# EAGLE design homecomputer-6502 (EAGLE 6.5.0)

## Sheet 1 of 4
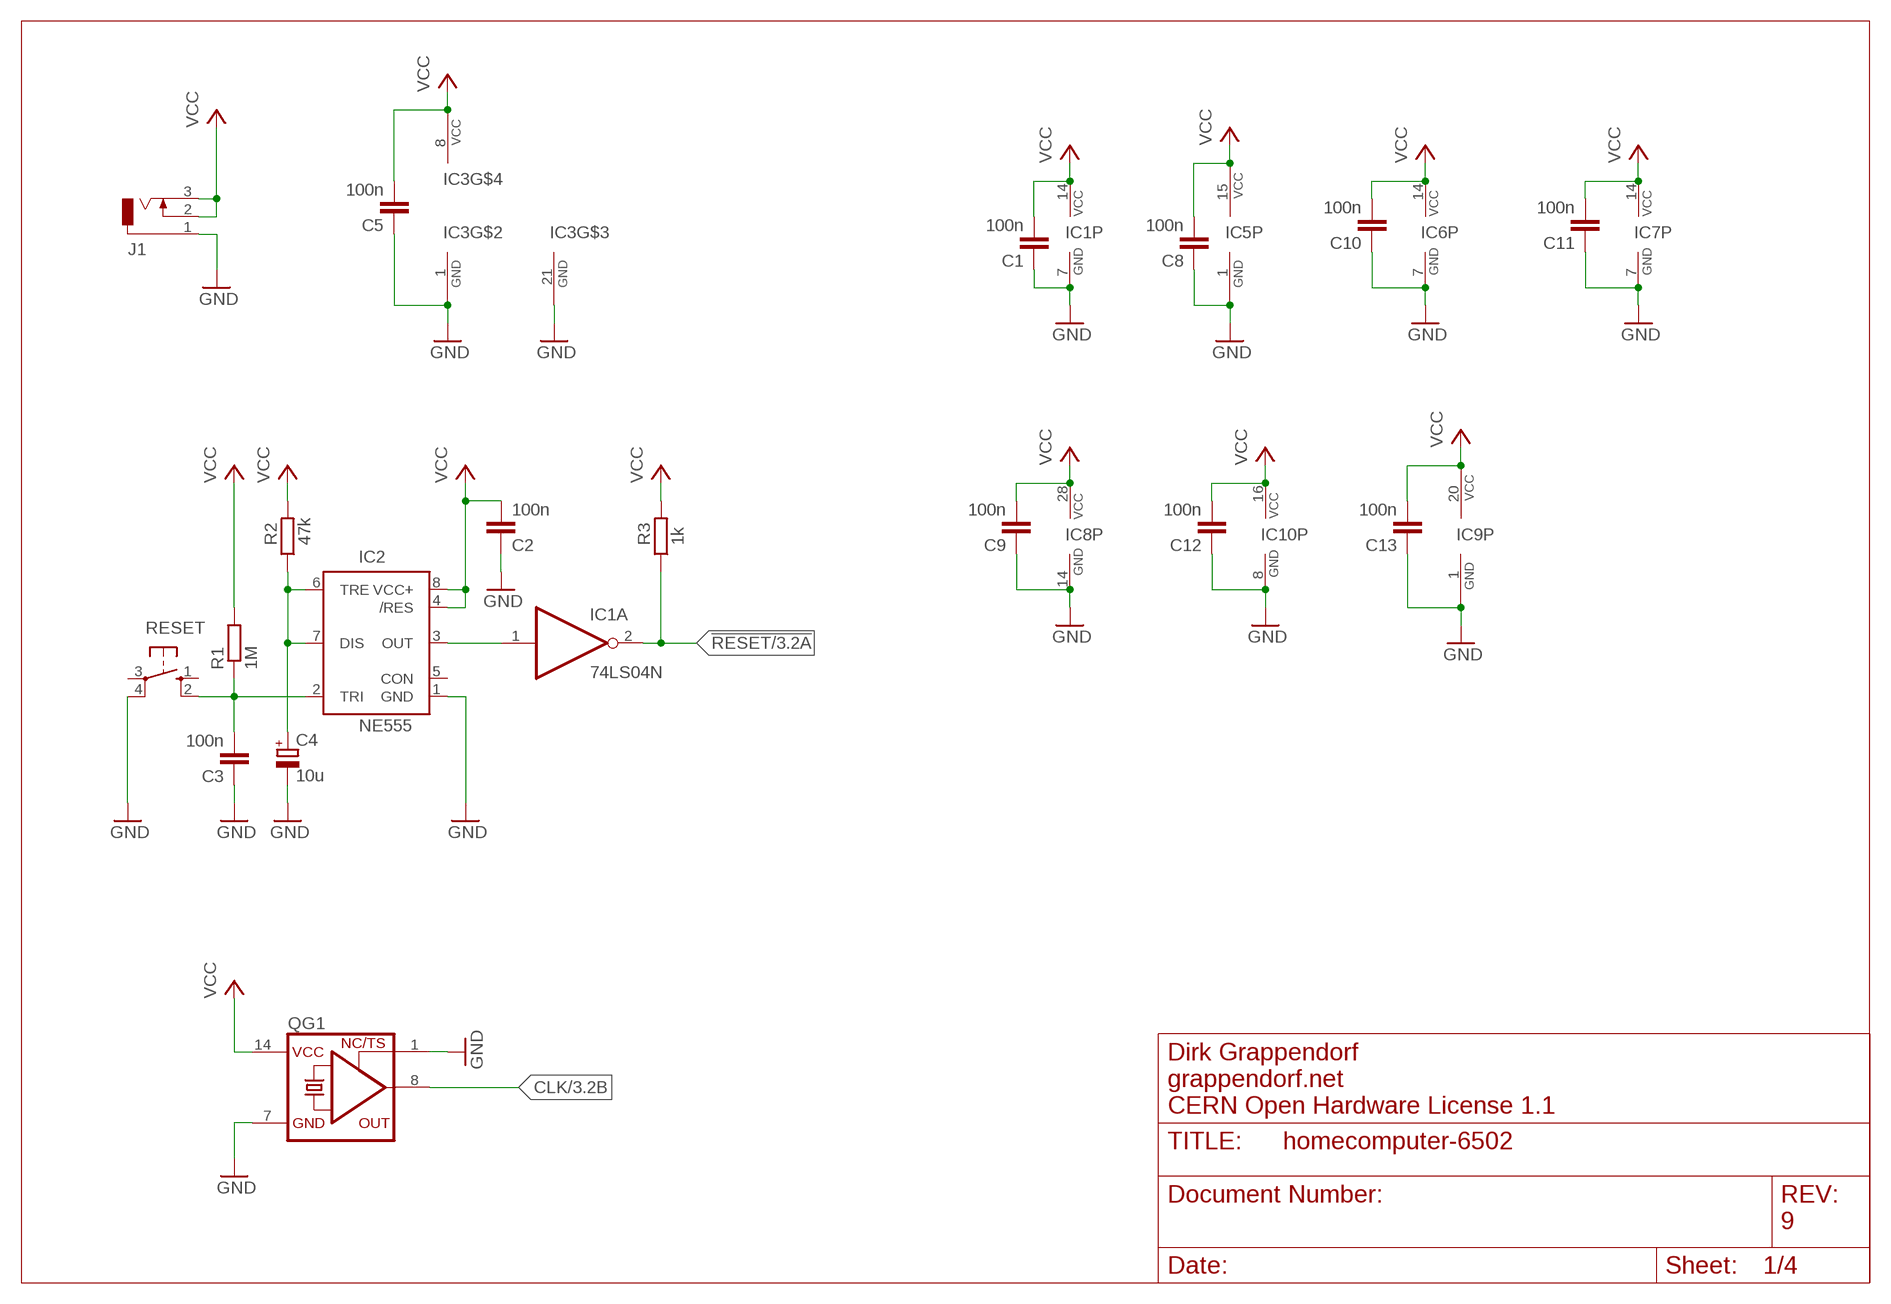
[diagram p0: schematic, sheet 1]

### Parts
C1  100n  C-EU025-024X044  [C025-024X044]
C2  100n  C-EU025-024X044  [C025-024X044]
C3  100n  C-EU025-024X044  [C025-024X044]
C4  10u  CPOL-EUE2,5-6E  [E2,5-6E]
C5  100n  C-EU025-024X044  [C025-024X044]
C8  100n  C-EU025-024X044  [C025-024X044]
C9  100n  C-EU025-024X044  [C025-024X044]
C10  100n  C-EU025-024X044  [C025-024X044]
C11  100n  C-EU025-024X044  [C025-024X044]
C12  100n  C-EU025-024X044  [C025-024X044]
C13  100n  C-EU025-024X044  [C025-024X044]
IC1  74LS04N  [DIL14]
IC2  NE555  [DIL-08]
IC3  6502  [DIP40]
IC5  6551  [DIP28]
IC6  74LS00N  [DIL14]
IC7  74LS30N  [DIL14]
IC8  61256  [DIL28-3]
IC9  6522  [DIP40]
IC10  74LS137N  [DIL16]
J1  DCJ0303  [DCJ0303]
QG1  XO-14  [DIL14S]
R1  1M  R-EU_0204/5  [0204/5]
R2  47k  R-EU_0204/5  [0204/5]
R3  1k  R-EU_0204/5  [0204/5]
RESET  10-XX  [B3F-10XX]

### Nets
!RESET: IC1.2(A:O) R3.1 ; also sheet 3,4
CLK: QG1.8(OUT) ; also sheet 3
GND: C1.1 C2.1 C3.1 C4.- C5.1 C8.1 C9.1 C10.1 C11.1 C12.1 C13.1 IC1.7(P:GND) IC2.1(GND) IC3.1(GND) IC3.21(GND) IC5.1(GND) IC6.7(P:GND) IC7.7(GND) IC8.14(GND) IC9.1(GND) IC10.8(GND) J1.1 QG1.1(TS) QG1.7(GND) RESET.4(P1) ; also sheet 2,3,4
N$4: C4.+ IC2.6(TRE) IC2.7(DIS) R2.1
N$5: IC1.1(A:I) IC2.3(OUT)
N$6: C3.2 IC2.2(TRI) R1.1 RESET.2(S1)
VCC: C1.2 C2.2 C5.2 C8.2 C9.2 C10.2 C11.2 C12.2 C13.2 IC1.14(P:VCC) IC2.4(/RES) IC2.8(VCC+) IC3.8(VCC) IC5.15(VCC) IC6.14(P:VCC) IC7.14(VCC) IC8.28(VCC) IC9.20(VCC) IC10.16(VCC) J1.2 J1.3 QG1.14(VCC) R1.2 R2.2 R3.2 ; also sheet 2,3,4
Unconnected: IC1.5(C:I) IC1.6(C:O) IC1.8(D:O) IC1.9(D:I) IC1.12(F:O) IC1.13(F:I) IC2.5(CON) IC6.8(C:O) IC6.9(C:I0) IC6.10(C:I1) IC6.11(D:O) IC6.12(D:I0) IC6.13(D:I1) RESET.1(S) RESET.3(P)

### Notes on the sheet
- Dirk Grappendorf
- grappendorf.net
- CERN Open Hardware License 1.1
- 9

## Sheet 2 of 4
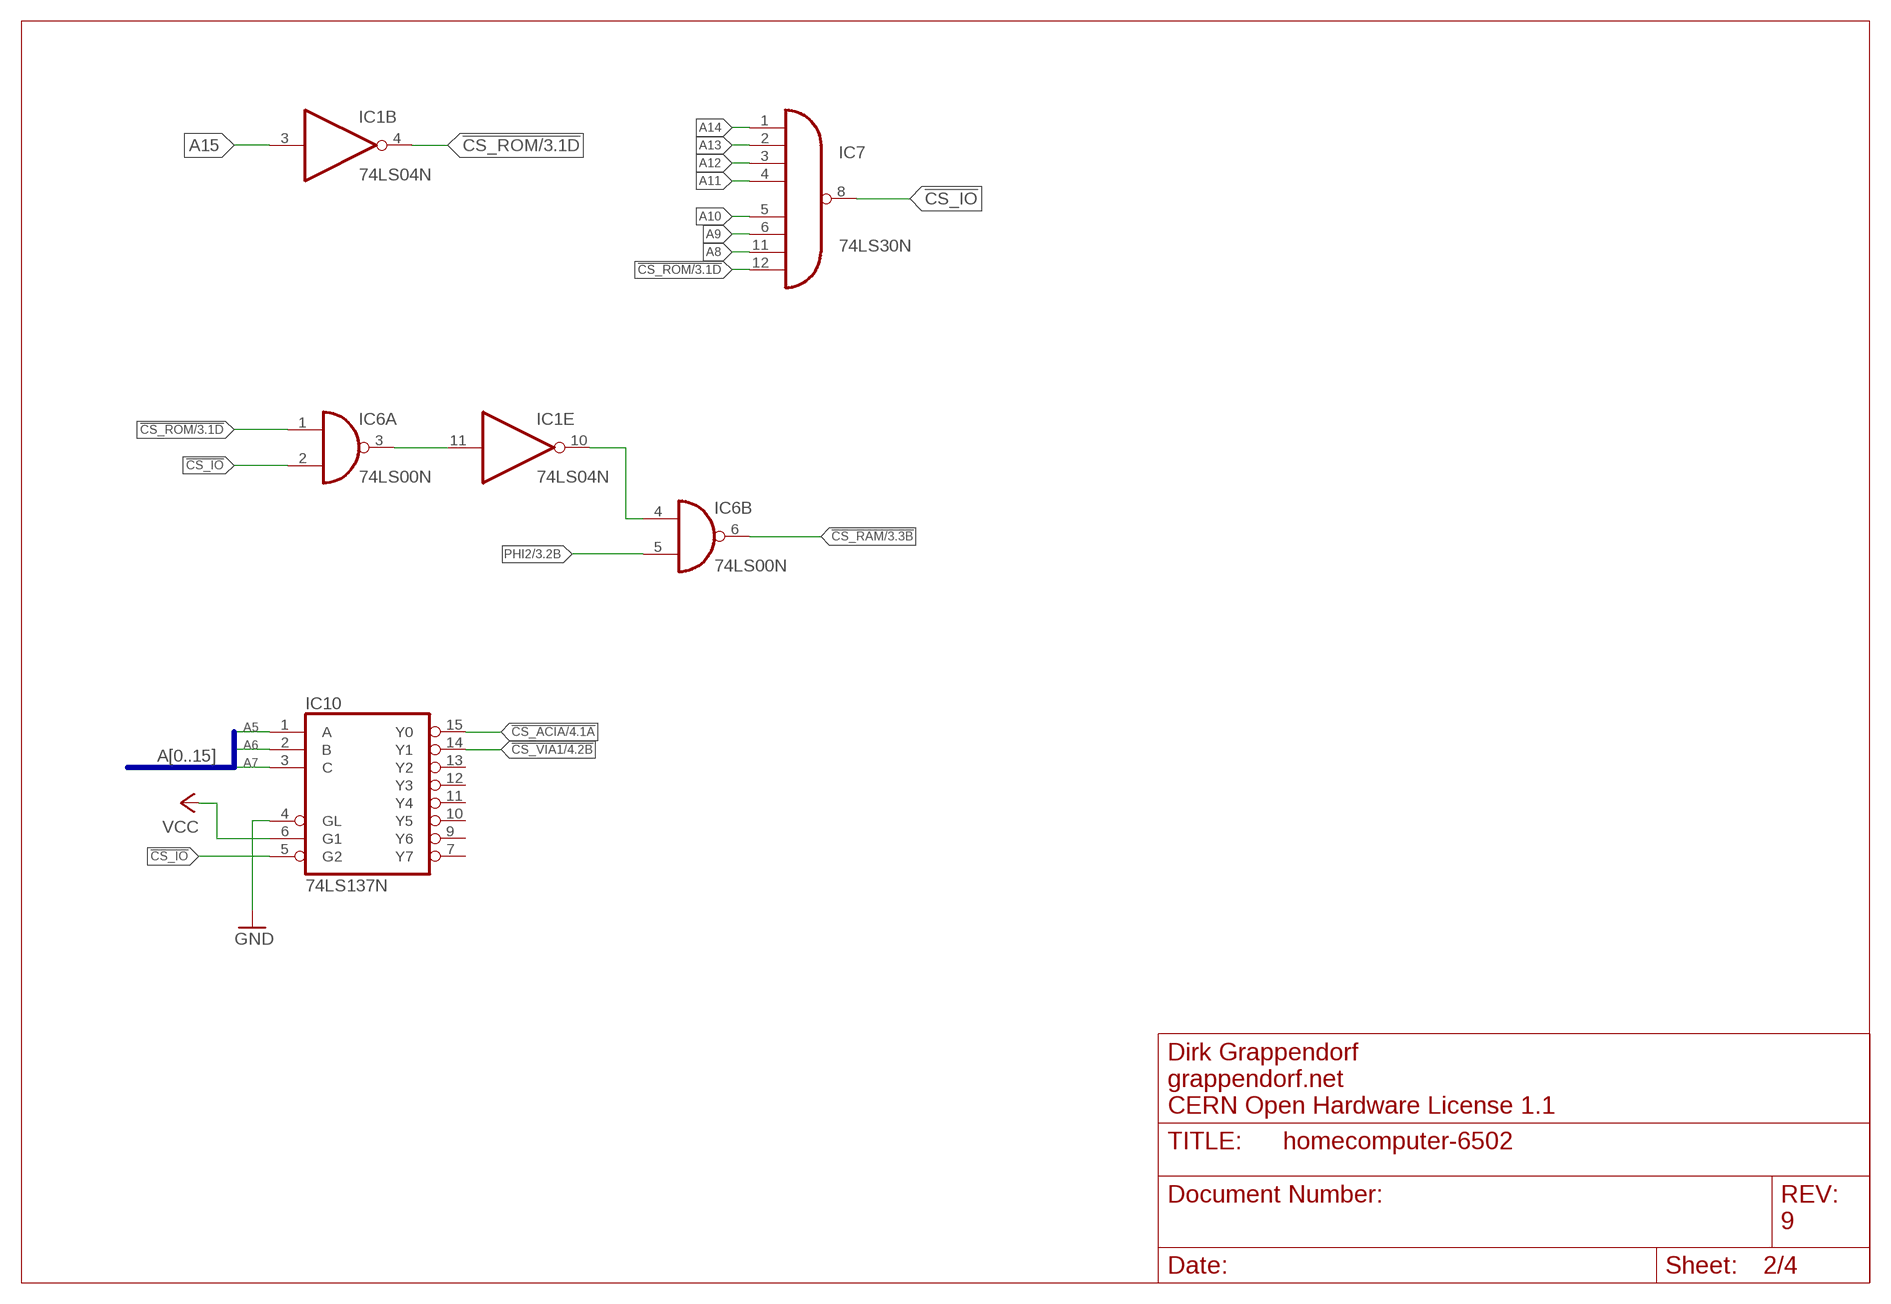
[diagram p1: schematic, sheet 2]

### Nets
!CS_ACIA: IC10.15(Y0) ; also sheet 4
!CS_IO: IC6.2(A:I1) IC7.8(O) IC10.5(G2)
!CS_RAM: IC6.6(B:O) ; also sheet 3
!CS_ROM: IC1.4(B:O) IC6.1(A:I0) IC7.12(I7) ; also sheet 3
!CS_VIA1: IC10.14(Y1) ; also sheet 4
A5: IC10.1(A) ; also sheet 3
A6: IC10.2(B) ; also sheet 3
A7: IC10.3(C) ; also sheet 3
A8: IC7.11(I6) ; also sheet 3
A9: IC7.6(I5) ; also sheet 3
A10: IC7.5(I4) ; also sheet 3
A11: IC7.4(I3) ; also sheet 3
A12: IC7.3(I2) ; also sheet 3
A13: IC7.2(I1) ; also sheet 3
A14: IC7.1(I0) ; also sheet 3
A15: IC1.3(B:I) ; also sheet 3
GND: IC10.4(GL) ; also sheet 1,3,4
N$7: IC1.11(E:I) IC6.3(A:O)
N$13: IC1.10(E:O) IC6.4(B:I0)
PHI2: IC6.5(B:I1) ; also sheet 3,4
VCC: IC10.6(G1) ; also sheet 1,3,4
Unconnected: IC10.7(Y7) IC10.9(Y6) IC10.10(Y5) IC10.11(Y4) IC10.12(Y3) IC10.13(Y2)

### Buses
A[0..15]

### Notes on the sheet
- Dirk Grappendorf
- grappendorf.net
- CERN Open Hardware License 1.1
- 9

## Sheet 3 of 4
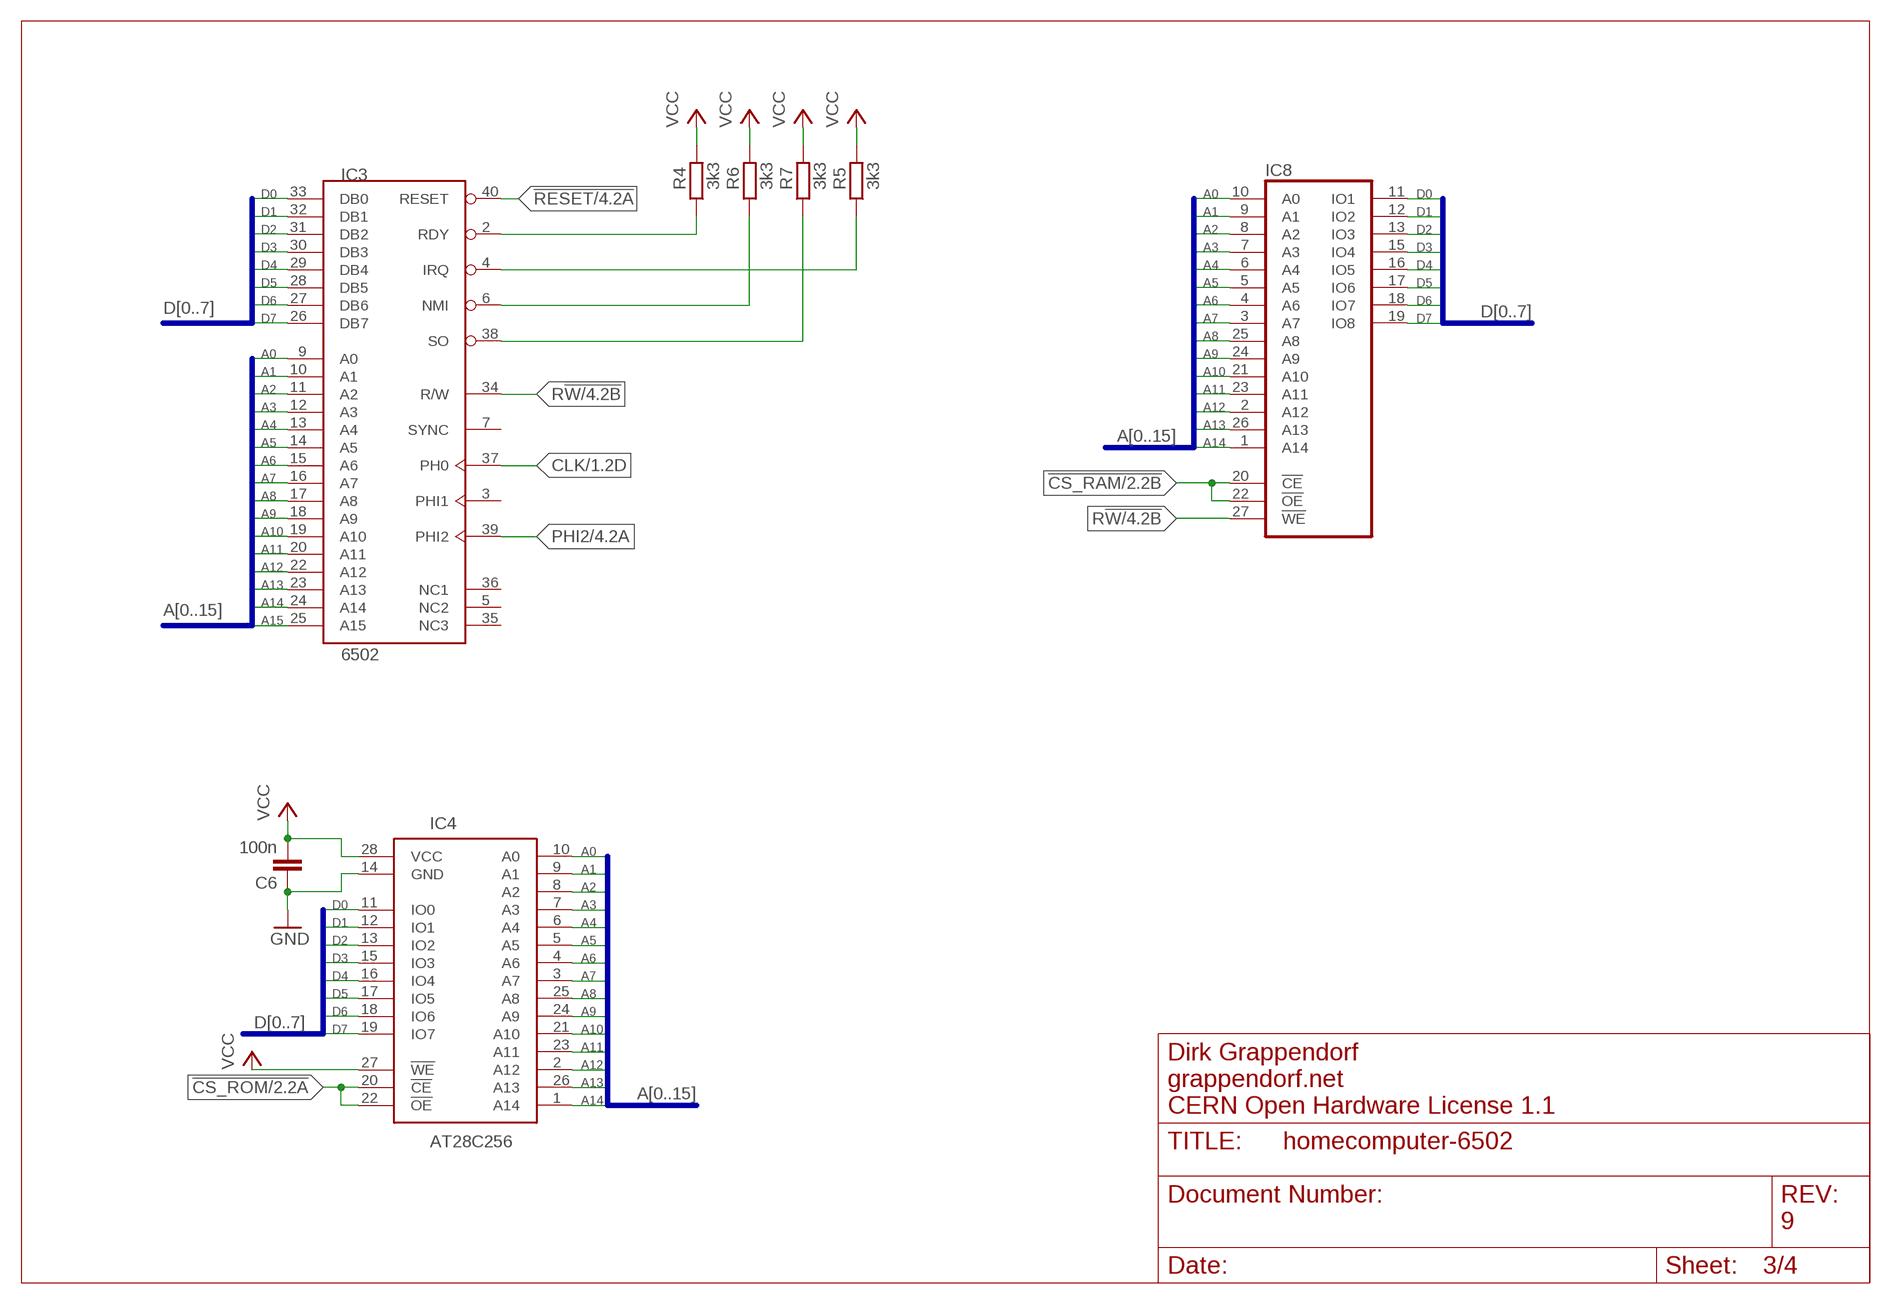
[diagram p2: schematic, sheet 3]

### Parts
C6  100n  C-EU025-024X044  [C025-024X044]
IC4  AT28C256  [DIL28-6]
R4  3k3  R-EU_0204/5  [0204/5]
R5  3k3  R-EU_0204/5  [0204/5]
R6  3k3  R-EU_0204/5  [0204/5]
R7  3k3  R-EU_0204/5  [0204/5]

### Nets
!CS_RAM: IC8.20(!CE) IC8.22(!OE) ; also sheet 2
!CS_ROM: IC4.20(!CE) IC4.22(!OE) ; also sheet 2
!IRQ: IC3.4(IRQ) R5.1
!RESET: IC3.40(RESET) ; also sheet 1,4
A0: IC3.9(A0) IC4.10(A0) IC8.10(A0) ; also sheet 4
A1: IC3.10(A1) IC4.9(A1) IC8.9(A1) ; also sheet 4
A2: IC3.11(A2) IC4.8(A2) IC8.8(A2) ; also sheet 4
A3: IC3.12(A3) IC4.7(A3) IC8.7(A3) ; also sheet 4
A4: IC3.13(A4) IC4.6(A4) IC8.6(A4)
A5: IC3.14(A5) IC4.5(A5) IC8.5(A5) ; also sheet 2
A6: IC3.15(A6) IC4.4(A6) IC8.4(A6) ; also sheet 2
A7: IC3.16(A7) IC4.3(A7) IC8.3(A7) ; also sheet 2
A8: IC3.17(A8) IC4.25(A8) IC8.25(A8) ; also sheet 2
A9: IC3.18(A9) IC4.24(A9) IC8.24(A9) ; also sheet 2
A10: IC3.19(A10) IC4.21(A10) IC8.21(A10) ; also sheet 2
A11: IC3.20(A11) IC4.23(A11) IC8.23(A11) ; also sheet 2
A12: IC3.22(A12) IC4.2(A12) IC8.2(A12) ; also sheet 2
A13: IC3.23(A13) IC4.26(A13) IC8.26(A13) ; also sheet 2
A14: IC3.24(A14) IC4.1(A14) IC8.1(A14) ; also sheet 2
A15: IC3.25(A15) ; also sheet 2
CLK: IC3.37(PH0) ; also sheet 1
D0: IC3.33(DB0) IC4.11(IO0) IC8.11(IO1) ; also sheet 4
D1: IC3.32(DB1) IC4.12(IO1) IC8.12(IO2) ; also sheet 4
D2: IC3.31(DB2) IC4.13(IO2) IC8.13(IO3) ; also sheet 4
D3: IC3.30(DB3) IC4.15(IO3) IC8.15(IO4) ; also sheet 4
D4: IC3.29(DB4) IC4.16(IO4) IC8.16(IO5) ; also sheet 4
D5: IC3.28(DB5) IC4.17(IO5) IC8.17(IO6) ; also sheet 4
D6: IC3.27(DB6) IC4.18(IO6) IC8.18(IO7) ; also sheet 4
D7: IC3.26(DB7) IC4.19(IO7) IC8.19(IO8) ; also sheet 4
GND: C6.1 IC4.14(GND) ; also sheet 1,2,4
N$3: IC3.2(RDY) R4.1
N$10: IC3.6(NMI) R6.1
N$11: IC3.38(SO) R7.1
PHI2: IC3.39(PHI2) ; also sheet 2,4
R!W: IC3.34(R/W) IC8.27(!WE) ; also sheet 4
VCC: C6.2 IC4.27(!WE) IC4.28(VCC) R4.2 R5.2 R6.2 R7.2 ; also sheet 1,2,4
Unconnected: IC3.3(PHI1) IC3.5(NC2) IC3.7(SYNC) IC3.35(NC3) IC3.36(NC1)

### Buses
A[0..15]
D[0..7]

### Notes on the sheet
- Dirk Grappendorf
- grappendorf.net
- CERN Open Hardware License 1.1
- 9

## Sheet 4 of 4
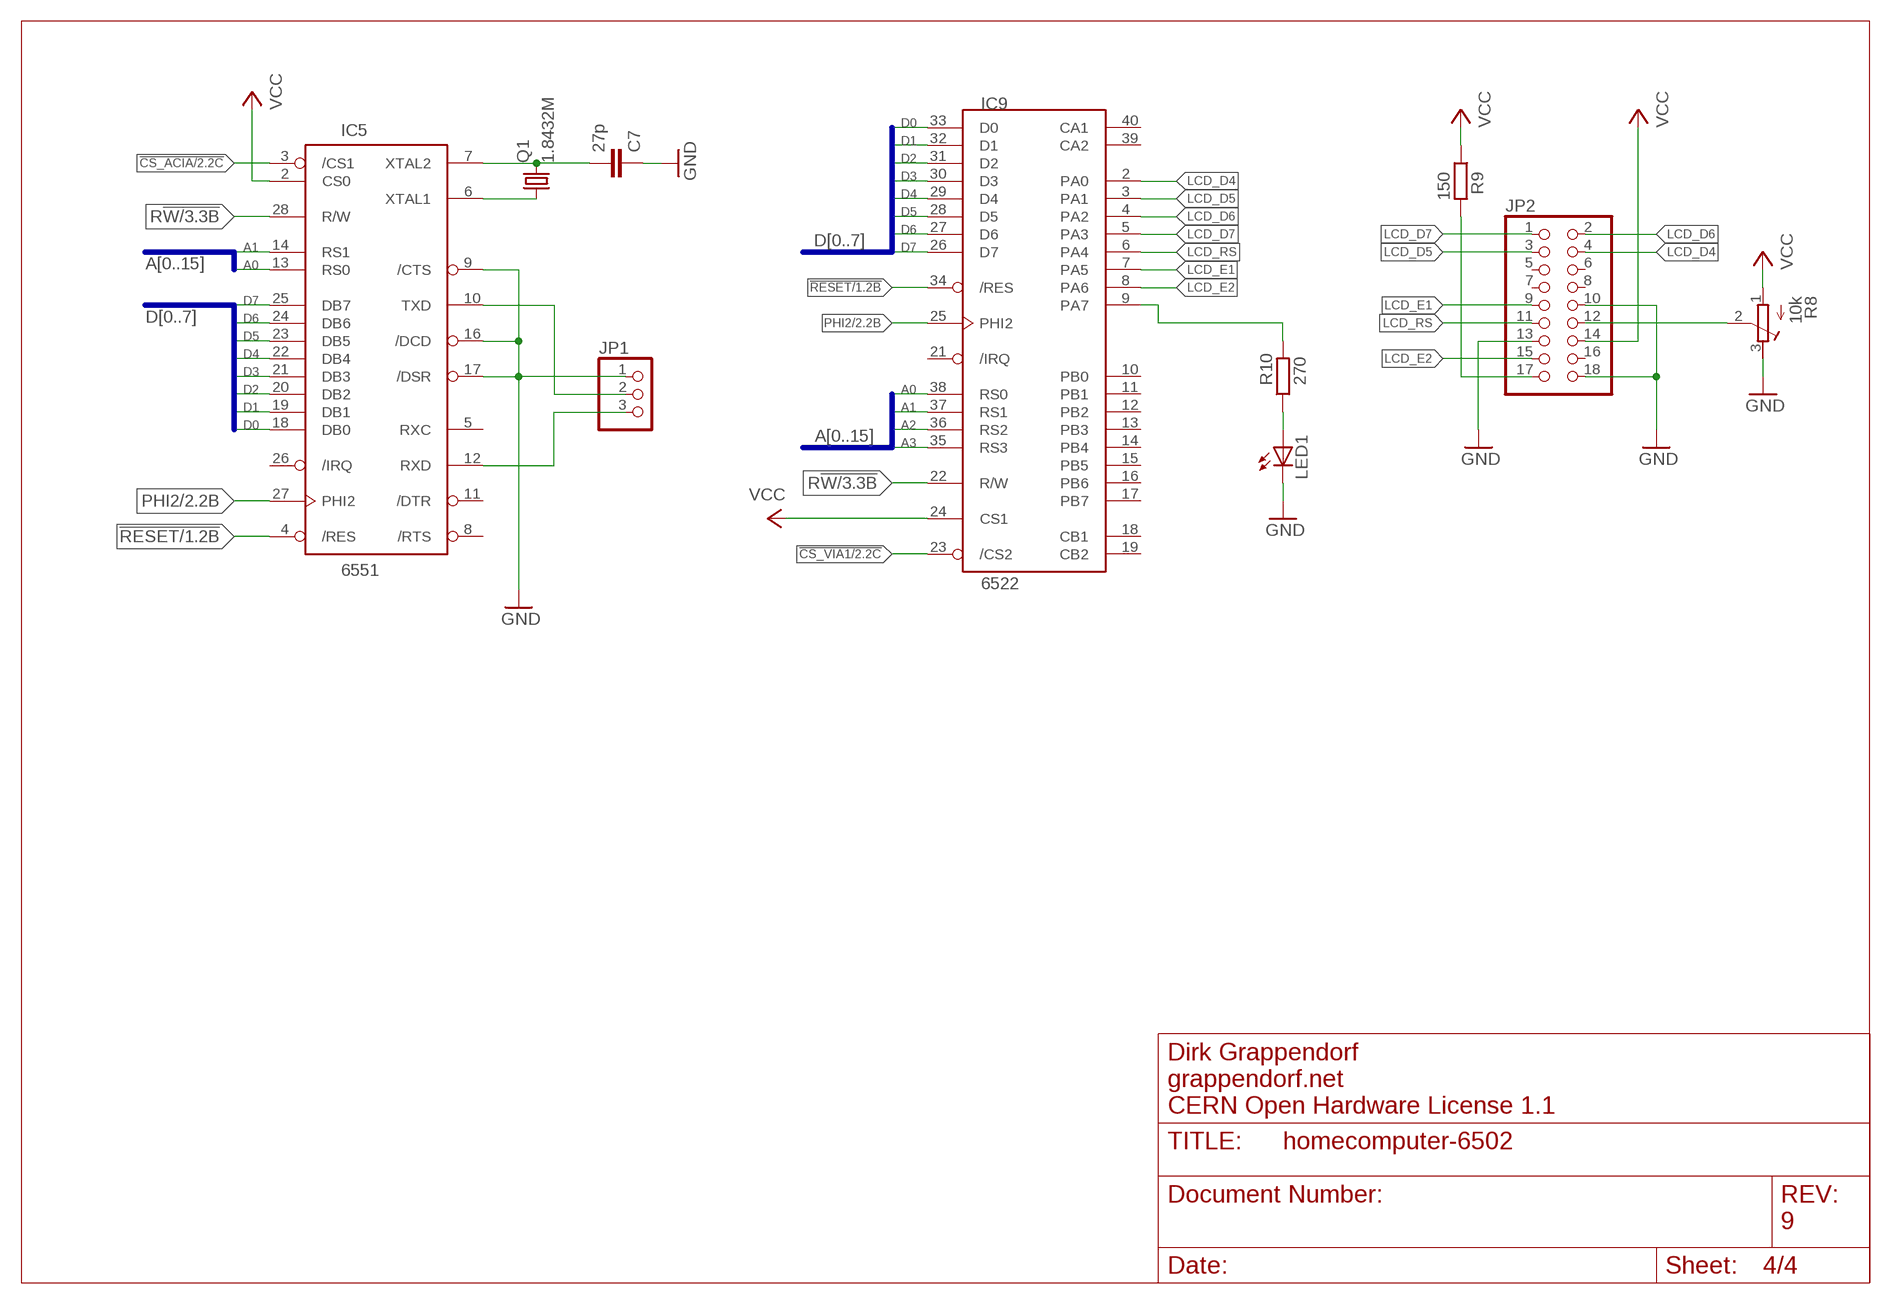
[diagram p3: schematic, sheet 4]

### Parts
C7  27p  C-EU025-024X044  [C025-024X044]
JP1  PINHD-1X3_2.54  [1X03]
JP2  PINHD-2X9_2.54  [2X09]
LED1  LED3MM  [LED3MM]
Q1  1.8432M  CRYSTALHC49U-V  [HC49U-V]
R8  10k  R-TRIMM3339P  [RTRIM3339P]
R9  150  R-EU_0204/5  [0204/5]
R10  270  R-EU_0204/5  [0204/5]

### Nets
!CS_ACIA: IC5.3(/CS1) ; also sheet 2
!CS_VIA1: IC9.23(/CS2) ; also sheet 2
!RESET: IC5.4(/RES) IC9.34(/RES) ; also sheet 1,3
A0: IC5.13(RS0) IC9.38(RS0) ; also sheet 3
A1: IC5.14(RS1) IC9.37(RS1) ; also sheet 3
A2: IC9.36(RS2) ; also sheet 3
A3: IC9.35(RS3) ; also sheet 3
D0: IC5.18(DB0) IC9.33(D0) ; also sheet 3
D1: IC5.19(DB1) IC9.32(D1) ; also sheet 3
D2: IC5.20(DB2) IC9.31(D2) ; also sheet 3
D3: IC5.21(DB3) IC9.30(D3) ; also sheet 3
D4: IC5.22(DB4) IC9.29(D4) ; also sheet 3
D5: IC5.23(DB5) IC9.28(D5) ; also sheet 3
D6: IC5.24(DB6) IC9.27(D6) ; also sheet 3
D7: IC5.25(DB7) IC9.26(D7) ; also sheet 3
GND: C7.1 IC5.9(/CTS) IC5.16(/DCD) IC5.17(/DSR) JP1.1 JP2.10 JP2.13 JP2.18 LED1.K(C) R8.3(E) ; also sheet 1,2,3
LCD_D4: IC9.2(PA0) JP2.4
LCD_D5: IC9.3(PA1) JP2.3
LCD_D6: IC9.4(PA2) JP2.2
LCD_D7: IC9.5(PA3) JP2.1
LCD_E1: IC9.7(PA5) JP2.9
LCD_E2: IC9.8(PA6) JP2.15
LCD_RS: IC9.6(PA4) JP2.11
N$1: C7.2 IC5.7(XTAL2) Q1.2
N$2: IC5.6(XTAL1) Q1.1
N$8: IC5.10(TXD) JP1.2
N$9: IC9.9(PA7) R10.2
N$12: IC5.12(RXD) JP1.3
N$14: JP2.12 R8.2(S)
N$15: JP2.17 R9.2
N$16: LED1.A R10.1
PHI2: IC5.27(PHI2) IC9.25(PHI2) ; also sheet 2,3
R!W: IC5.28(R/W) IC9.22(R/W) ; also sheet 3
VCC: IC5.2(CS0) IC9.24(CS1) JP2.14 R8.1(A) R9.1 ; also sheet 1,2,3
Unconnected: IC5.5(RXC) IC5.8(/RTS) IC5.11(/DTR) IC5.26(/IRQ) IC9.10(PB0) IC9.11(PB1) IC9.12(PB2) IC9.13(PB3) IC9.14(PB4) IC9.15(PB5) IC9.16(PB6) IC9.17(PB7) IC9.18(CB1) IC9.19(CB2) IC9.21(/IRQ) IC9.39(CA2) IC9.40(CA1) JP2.5 JP2.6 JP2.7 JP2.8 JP2.16

### Buses
A[0..15]
D[0..7]

### Notes on the sheet
- Dirk Grappendorf
- grappendorf.net
- CERN Open Hardware License 1.1
- 9

## Library data of the parts
C1-C3 C5-C13 = rcl:C-EU: CAPACITOR, European symbol
C4 = rcl:CPOL-EU: POLARIZED CAPACITOR, European symbol
IC1 = 74xx-eu:74*04: Hex INVERTER
IC2 = st-microelectronics:NE555: General purpose bipolar Timer; MF: Arrow Electronics; MPN: NE555N; OC_FARNELL: 1467742; OC_NEWARK: 89K1486
IC3 = 6502:6502: 6502 processor
IC4 = atmel-28c:AT28C256: EEPROM 32Kx8 256k bit The AT28C256 is a high-performance Electrically Erasable and Programmable Read Only Memory. Its 256K of memory is organized as 32,768 words by 8 bits.
IC5 = 6502:6551: ACIA. Capable of RS-232
IC6 = 74xx-eu:74*00: Quad 2-input NAND gate
IC7 = 74xx-eu:74*30: 8-input NAND gate
IC8 = grapelabs:61256: MEMORY
IC9 = 6502:6522: I/O device: two 8-bits ports, handshake lines, timers.
IC10 = 74xx-eu:74*137: 3-line to 8-line DECODER/DEMULTIPLEXER, address LATCH
J1 = con-jack:DCJ0303: DC POWER JACK Source: DCJ0303.pdf; OC_FARNELL: unknown; OC_NEWARK: unknown
JP1 = pinhead-1:PINHD-1X3: PIN HEADER
JP2 = pinhead-1:PINHD-2X9: PIN HEADER
LED1 = led:LED: LED OSRAM: - CHIPLED LG R971, LG N971, LY N971, LG Q971, LY Q971, LO R971, LY R971 LH N974, LH R974 LS Q976, LO Q976, LY Q976 LO Q996 - Hyper CHIPLED LW Q18S LB Q993, LB Q99A, LB R99A - SideLED LS A670, LO A670, LY A670, LG A670, LP A670 LB A673, LV A673, LT A673, LW A673 LH A674 LY A675 LS A676, LA A676, LO A676, LY A676, LW A676 LS A679, LY A679, LG A679 - Hyper Micro SIDELED® LS Y876, LA Y876, LO Y876, LY Y876 LT Y87S - SmartLED LW L88C, LW L88S LB L89C, LB L89S, LG L890 LS L89K, LO L89K, LY L89K LS L896, LA L896, LO L896, LY L896 - TOPLED LS T670, LO T670, LY T670, LG T670, LP T670 LSG T670, LSP T670, LSY T670, LOP T670, LYG T670 LG T671, LOG T671, LSG T671 LB T673, LV T673, LT T673, LW T673 LH T674 LS T676, LA T676, LO T676, LY T676, LB T676, LH T676, LSB T676, LW T676 LB T67C, LV T67C, LT T67C, LS T67K, LO T67K, LY T67K, LW E67C LS E67B, LA E67B, LO E67B, LY E67B, LB E67C, LV E67C, LT E67C LW T67C LS T679, LY T679, LG T679 LS T770, LO T770, LY T770, LG T770, LP T770 LB T773, LV T773, LT T773, LW T773 LH T774 LS E675, LA E675, LY E675, LS T675 LS T776, LA T776, LO T776, LY T776, LB T776 LHGB T686 LT T68C, LB T68C - Hyper Mini TOPLED® LB M676 - Mini TOPLED Santana® LG M470 LS M47K, LO M47K, LY M47K Source: http://www.osram.convergy.de LUXEON: - LUMILED® LXK2-PW12-R00, LXK2-PW12-S00, LXK2-PW14-U00, LXK2-PW14-V00 LXK2-PM12-R00, LXK2-PM12-S00, LXK2-PM14-U00 LXK2-PE12-Q00, LXK2-PE12-R00, LXK2-PE12-S00, LXK2-PE14-T00, LXK2-PE14-U00 LXK2-PB12-K00, LXK2-PB12-L00, LXK2-PB12-M00, LXK2-PB14-N00, LXK2-PB14-P00, LXK2-PB14-Q00 LXK2-PR12-L00, LXK2-PR12-M00, LXK2-PR14-Q00, LXK2-PR14-R00 LXK2-PD12-Q00, LXK2-PD12-R00, LXK2-PD12-S00 LXK2-PH12-R00, LXK2-PH12-S00 LXK2-PL12-P00, LXK2-PL12-Q00, LXK2-PL12-R00 Source: www.luxeon.com KINGBRIGHT: KA-3528ASYC Source: www.kingbright.com
Q1 = crystal:CRYSTAL: CRYSTAL; OC_FARNELL: 1666969; OC_NEWARK: unknown
QG1 = crystal2:XO-: CRYSTAL
R1-R7 R9 R10 = rcl:R-EU_: RESISTOR, European symbol
R8 = rcl:R-TRIMM: Trimm resistor
RESET = switch-omron:10-XX: OMRON SWITCH; MPN: B3F-1000; OC_FARNELL: 176432; OC_NEWARK: 36M3542

## Board
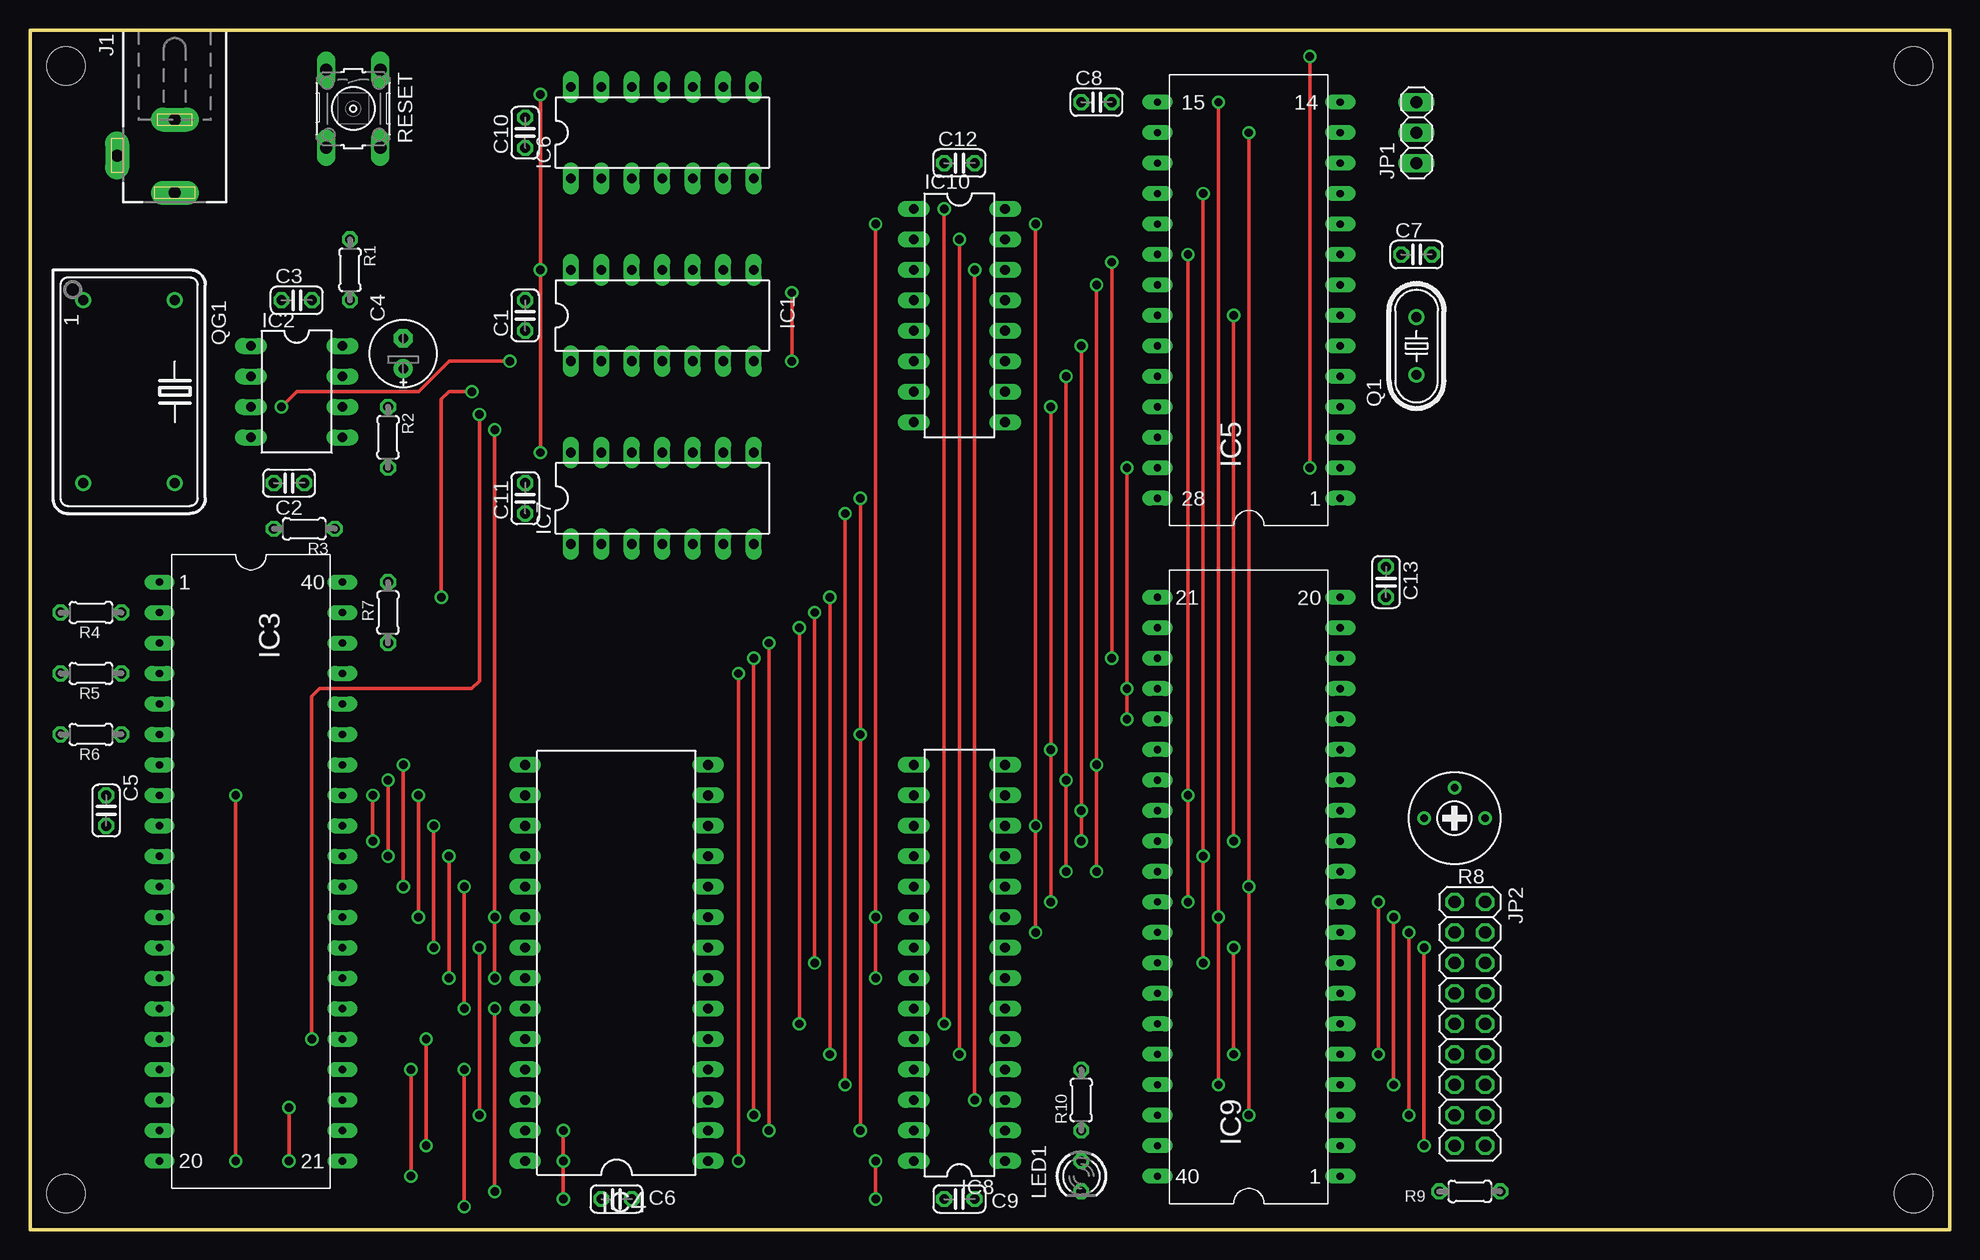
[diagram p4: board, top side]
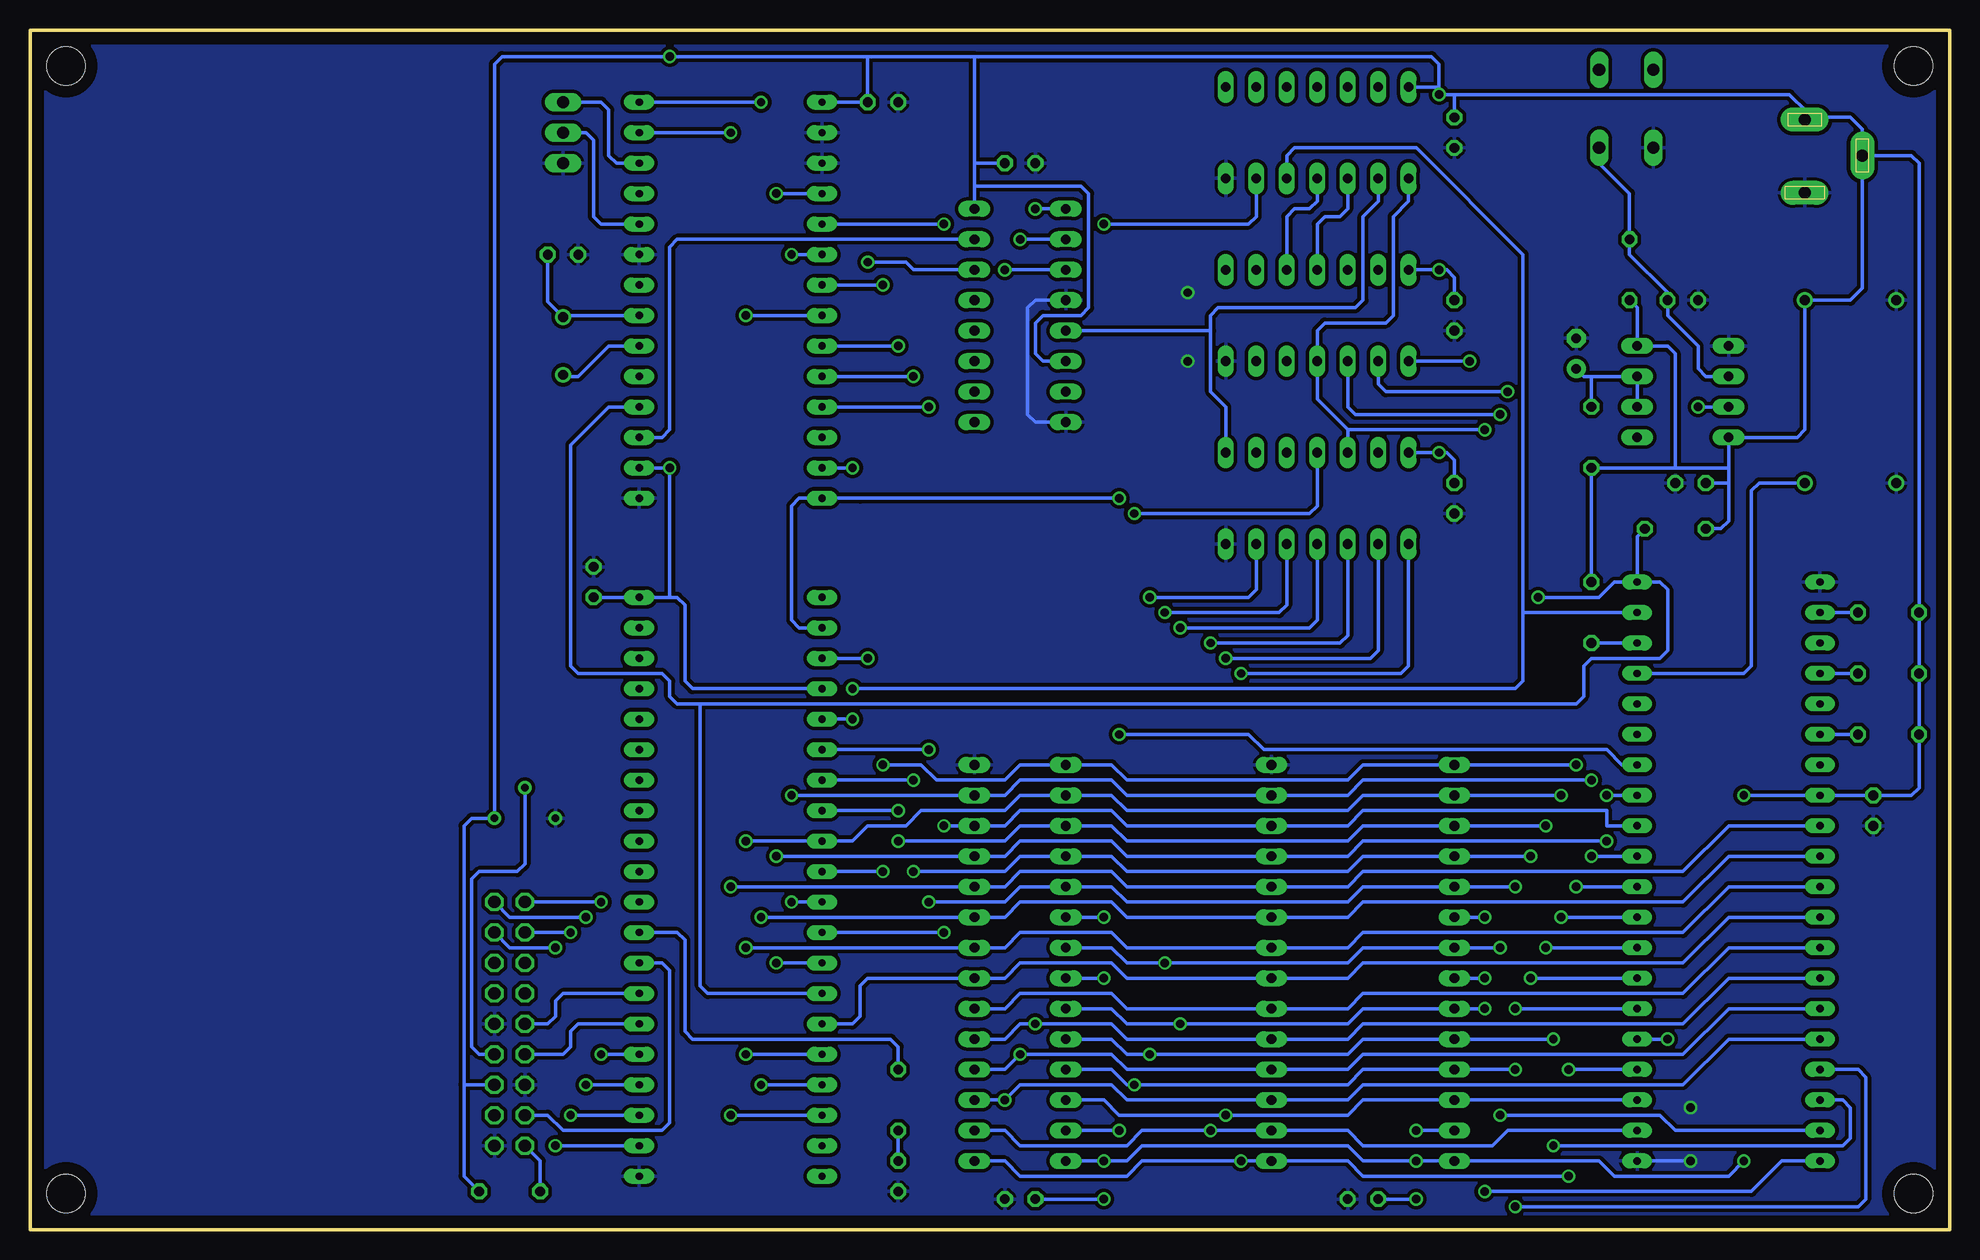
[diagram p5: board, bottom side, seen from below]

Size 160 x 100 mm. Coordinates in mm from the lower left corner, seen from the top.
Outline: 0,0 160,0 160,100 0,100 0,0
Copper layers (1*2*16): Top 0.035mm / dielectric 0.75mm / Route2 0.035mm / dielectric 0.75mm / Bottom 0.035mm
Design rules "default *": minimum track width 10mil, minimum drill 24mil, track to track 8mil, track to pad 8mil, pad to pad 8mil, via to via 8mil, smd to smd 8mil, copper to edge 40mil, drill to drill 8mil, minimum pad ring 10mil, minimum via ring 8mil, stop-mask expansion 4mil, vias tented up to drill 0mil, thermal gap 10mil
Holes 3.2 mm at 3,97 157,97 3,3 157,3

### Footprints (pad centres in the part's own frame; a part is rotated, then mirrored left to right if it is on the bottom)
C025-024X044 = drill 0.813 octagon: 1 -1.27,0; 2 1.27,0
E2,5-6E = drill 0.813 pad 1.575: + -1.27,0 | drill 0.813 pad 1.575 octagon: - 1.27,0
DIL14 = drill 0.813 long: 1 -7.62,-3.81; 2 -5.08,-3.81; 3 -2.54,-3.81; 4 0,-3.81; 5 2.54,-3.81; 6 5.08,-3.81; 7 7.62,-3.81; 8 7.62,3.81; 9 5.08,3.81; 10 2.54,3.81; 11 0,3.81; 12 -2.54,3.81; 13 -5.08,3.81; 14 -7.62,3.81
DIL-08 = drill 0.813 long: 1 -3.81,-3.81; 2 -1.27,-3.81; 3 1.27,-3.81; 4 3.81,-3.81; 5 3.81,3.81; 6 1.27,3.81; 7 -1.27,3.81; 8 -3.81,3.81
DIP40 = drill 0.61 pad 1.27 long: 1 -24.13,-7.62; 2 -21.59,-7.62; 3 -19.05,-7.62; 4 -16.51,-7.62; 5 -13.97,-7.62; 6 -11.43,-7.62; 7 -8.89,-7.62; 8 -6.35,-7.62; 9 -3.81,-7.62; 10 -1.27,-7.62; 11 1.27,-7.62; 12 3.81,-7.62; 13 6.35,-7.62; 14 8.89,-7.62; 15 11.43,-7.62; 16 13.97,-7.62; 17 16.51,-7.62; 18 19.05,-7.62; 19 21.59,-7.62; 20 24.13,-7.62; 21 24.13,7.62; 22 21.59,7.62; 23 19.05,7.62; 24 16.51,7.62; 25 13.97,7.62; 26 11.43,7.62; 27 8.89,7.62; 28 6.35,7.62; 29 3.81,7.62; 30 1.27,7.62; 31 -1.27,7.62; 32 -3.81,7.62; 33 -6.35,7.62; 34 -8.89,7.62; 35 -11.43,7.62; 36 -13.97,7.62; 37 -16.51,7.62; 38 -19.05,7.62; 39 -21.59,7.62; 40 -24.13,7.62
DIL28-6 = drill 0.813 long: 1 -16.51,-7.62; 2 -13.97,-7.62; 3 -11.43,-7.62; 4 -8.89,-7.62; 5 -6.35,-7.62; 6 -3.81,-7.62; 7 -1.27,-7.62; 8 1.27,-7.62; 9 3.81,-7.62; 10 6.35,-7.62; 11 8.89,-7.62; 12 11.43,-7.62; 13 13.97,-7.62; 14 16.51,-7.62; 15 16.51,7.62; 16 13.97,7.62; 17 11.43,7.62; 18 8.89,7.62; 19 6.35,7.62; 20 3.81,7.62; 21 1.27,7.62; 22 -1.27,7.62; 23 -3.81,7.62; 24 -6.35,7.62; 25 -8.89,7.62; 26 -11.43,7.62; 27 -13.97,7.62; 28 -16.51,7.62
DIP28 = drill 0.61 pad 1.27 long: 1 -16.51,-7.62; 2 -13.97,-7.62; 3 -11.43,-7.62; 4 -8.89,-7.62; 5 -6.35,-7.62; 6 -3.81,-7.62; 7 -1.27,-7.62; 8 1.27,-7.62; 9 3.81,-7.62; 10 6.35,-7.62; 11 8.89,-7.62; 12 11.43,-7.62; 13 13.97,-7.62; 14 16.51,-7.62; 15 16.51,7.62; 16 13.97,7.62; 17 11.43,7.62; 18 8.89,7.62; 19 6.35,7.62; 20 3.81,7.62; 21 1.27,7.62; 22 -1.27,7.62; 23 -3.81,7.62; 24 -6.35,7.62; 25 -8.89,7.62; 26 -11.43,7.62; 27 -13.97,7.62; 28 -16.51,7.62
DIL28-3 = drill 0.813 long: 1 -16.51,-3.81; 2 -13.97,-3.81; 3 -11.43,-3.81; 4 -8.89,-3.81; 5 -6.35,-3.81; 6 -3.81,-3.81; 7 -1.27,-3.81; 8 1.27,-3.81; 9 3.81,-3.81; 10 6.35,-3.81; 11 8.89,-3.81; 12 11.43,-3.81; 13 13.97,-3.81; 14 16.51,-3.81; 15 16.51,3.81; 16 13.97,3.81; 17 11.43,3.81; 18 8.89,3.81; 19 6.35,3.81; 20 3.81,3.81; 21 1.27,3.81; 22 -1.27,3.81; 23 -3.81,3.81; 24 -6.35,3.81; 25 -8.89,3.81; 26 -11.43,3.81; 27 -13.97,3.81; 28 -16.51,3.81
DIL16 = drill 0.813 long: 1 -8.89,-3.81; 2 -6.35,-3.81; 3 -3.81,-3.81; 4 -1.27,-3.81; 5 1.27,-3.81; 6 3.81,-3.81; 7 6.35,-3.81; 8 8.89,-3.81; 9 8.89,3.81; 10 6.35,3.81; 11 3.81,3.81; 12 1.27,3.81; 13 -1.27,3.81; 14 -3.81,3.81; 15 -6.35,3.81; 16 -8.89,3.81
DCJ0303 = drill 1 pad 2 long: 1 0,3.1; 2 4.8,0; 3 0,-3
1X03 = drill 1.016 long: 1 -2.54,0; 2 0,0; 3 2.54,0
2X09 = drill 1.016 octagon: 1 -10.16,-1.27; 2 -10.16,1.27; 3 -7.62,-1.27; 4 -7.62,1.27; 5 -5.08,-1.27; 6 -5.08,1.27; 7 -2.54,-1.27; 8 -2.54,1.27; 9 0,-1.27; 10 0,1.27; 11 2.54,-1.27; 12 2.54,1.27; 13 5.08,-1.27; 14 5.08,1.27; 15 7.62,-1.27; 16 7.62,1.27; 17 10.16,-1.27; 18 10.16,1.27
LED3MM = drill 0.813 octagon: A -1.27,0; K 1.27,0
HC49U-V = drill 0.813: 1 -2.413,0; 2 2.413,0
DIL14S = drill 0.813: 1 -7.62,-3.81; 7 7.62,-3.81; 8 7.62,3.81; 14 -7.62,3.81
0204/5 = drill 0.813 octagon: 1 -2.54,0; 2 2.54,0
RTRIM3339P = drill 0.61: 1 -2.54,0; 2 0,-2.54; 3 2.54,0
B3F-10XX = drill 1.016 long: 1 -3.251,2.261; 2 3.251,2.261; 3 -3.251,-2.261; 4 3.251,-2.261

### Placement (x,y rotation side)
C1  41.27,76.2 90 top
C2  21.59,62.23 180 top
C3  22.23,77.47 0 top
C4  31.11,73.03 90 top
C5  6.35,34.92 90 top
C6  48.9,2.54 180 top
C7  115.57,81.28 0 top
C8  88.9,93.98 0 top
C9  77.47,2.54 180 top
C10  41.27,91.44 90 top
C11  41.27,60.96 90 top
C12  77.47,88.9 0 top
C13  113.03,53.98 270 top
IC1  52.7,76.2 0 top
IC2  22.23,69.85 270 top
IC3  18.41,29.84 270 top
IC4  48.9,22.23 90 top
IC5  101.6,77.47 90 top
IC6  52.7,91.44 0 top
IC7  52.7,60.96 0 top
IC8  77.47,22.23 90 top
IC9  101.6,28.57 90 top
IC10  77.47,76.2 270 top
J1  12.06,89.53 180 top
JP1  115.57,91.44 90 top
JP2  120.02,17.14 270 top
LED1  87.63,4.45 270 top
Q1  115.57,73.66 90 top
QG1  8.26,69.85 270 top
R1  26.67,80.01 270 top
R2  29.84,66.04 270 top
R3  22.86,58.42 180 top
R4  5.08,51.44 180 top
R5  5.08,46.35 180 top
R6  5.08,41.27 180 top
R7  29.84,51.44 90 top
R8  118.75,34.29 180 top
R9  120.02,3.17 180 top
R10  87.63,10.79 90 top
RESET  26.94,93.44 270 top

### Tracks (layer width: path | path; a pad name or v marks a point on that pad's centre or on a via)
!CS_ACIA
  Bottom 0.305: IC10.15 106.05,82.55 106.68,81.92 106.68,66.67 107.31,66.04 IC5.3
!CS_IO
  Bottom 0.305: IC7.8 60.33,68.58 61.59,69.85 61.59,74.93 | 61.59,74.93 61.59,76.2 60.96,76.83 49.53,76.83 48.9,77.47 48.9,84.45 47.62,85.72 IC6.2 | IC10.5 61.59,74.93
!CS_RAM  (via drill 0.7)
  Top 0.305: v70.48,83.82 v70.48,26.04 v70.48,20.95
  Bottom 0.305: IC8.20 v70.48,26.04 | v70.48,83.82 58.42,83.82 57.78,84.45 IC6.6 | IC8.22 v70.48,20.95
!CS_ROM  (via drill 0.7)
  Top 0.305: v38.73,66.67 v38.73,26.04 v38.73,20.95
  Bottom 0.305: IC4.20 v38.73,26.04 | v38.73,66.67 50.16,66.67 | 50.16,66.67 52.7,69.22 | 52.7,69.22 IC1.4 | IC7.12 50.16,66.67 | 52.7,69.22 52.7,74.93 52.07,75.56 46.99,75.56 46.35,76.2 46.35,84.45 45.09,85.72 IC6.1 | IC4.22 v38.73,20.95
!CS_VIA1  (via drill 0.7)
  Top 0.305: v90.17,47.62 v90.17,80.64
  Bottom 0.305: v90.17,80.64 87,80.64 86.36,80.01 IC10.14 | IC9.23 v90.17,47.62
!IRQ
  Bottom 0.305: IC3.4 R5.1
!RESET  (via drill 0.7)
  Top 0.305: v34.29,52.7 34.29,69.22 34.92,69.85 v36.83,69.85
  Bottom 0.305: R3.1 26.04,57.78 IC3.40 | IC3.40 24.13,53.98 23.5,53.34 23.5,48.26 24.13,47.62 29.84,47.62 30.48,46.99 30.48,44.45 31.11,43.81 104.14,43.81 | IC3.40 27.94,53.98 29.21,52.7 v34.29,52.7 | IC1.2 47.62,70.48 46.99,69.85 v36.83,69.85 | 104.14,43.81 106.05,43.81 106.68,44.45 106.68,45.72 107.31,46.35 114.3,46.35 114.94,46.99 114.94,65.41 111.76,68.58 IC5.4 | IC9.34 103.5,19.68 104.14,20.32 104.14,43.81
A0  (via drill 0.7)
  Top 0.305: v101.6,9.53 v101.6,28.57 v101.6,91.44
  Bottom 0.305: IC3.9 18.41,33.66 22.23,29.84 48.9,29.84 50.16,28.57 IC4.10 68.58,28.57 69.85,29.84 77.47,29.84 78.74,28.57 IC8.10 v101.6,28.57 | v101.6,9.53 IC9.38 | v101.6,91.44 IC5.13
A1  (via drill 0.7)
  Top 0.305: v99.06,12.06 v99.06,26.04 v99.06,93.98
  Bottom 0.305: IC3.10 18.41,31.11 22.23,27.3 48.9,27.3 50.16,26.04 IC4.9 68.58,26.04 69.85,27.3 77.47,27.3 78.74,26.04 IC8.9 v99.06,26.04 | v99.06,12.06 IC9.37 | v99.06,93.98 IC5.14
A2  (via drill 0.7)
  Top 0.305: v100.33,23.5 v100.33,14.61
  Bottom 0.305: IC3.11 18.41,28.57 22.23,24.77 48.9,24.77 50.16,23.5 IC4.8 68.58,23.5 69.85,24.77 77.47,24.77 78.74,23.5 IC8.8 v100.33,23.5 | v100.33,14.61 IC9.36
A3
  Bottom 0.305: IC3.12 18.41,26.04 22.23,22.23 48.9,22.23 50.16,20.95 IC4.7 68.58,20.95 69.85,22.23 77.47,22.23 78.74,20.95 IC8.7 90.17,20.95 90.81,20.32 90.81,17.78 91.44,17.14 IC9.35
A4
  Bottom 0.305: IC3.13 18.41,23.5 22.23,19.68 48.9,19.68 50.16,18.41 IC4.6 68.58,18.41 69.85,19.68 77.47,19.68 78.74,18.41 IC8.6
A5  (via drill 0.7)
  Top 0.305: v76.2,17.14 v76.2,85.09
  Bottom 0.305: IC3.14 18.41,20.95 22.23,17.14 48.9,17.14 50.16,15.88 IC4.5 68.58,15.88 69.85,17.14 v76.2,17.14 77.47,17.14 78.74,15.88 IC8.5 | IC10.1 v76.2,85.09
A6  (via drill 0.7)
  Top 0.305: v77.47,14.61 v77.47,82.55
  Bottom 0.305: IC3.15 18.41,18.41 22.23,14.61 48.9,14.61 50.16,13.34 IC4.4 68.58,13.34 69.85,14.61 v77.47,14.61 78.74,13.34 IC8.4 | IC10.2 v77.47,82.55
A7  (via drill 0.7)
  Top 0.305: v78.74,80.01 v78.74,10.79
  Bottom 0.305: IC3.16 18.41,15.88 22.23,12.06 48.9,12.06 50.16,10.79 IC4.3 62.87,10.79 68.58,10.79 69.85,12.06 77.47,12.06 v78.74,10.79 IC8.3 | IC10.3 v78.74,80.01
A8  (via drill 0.7)
  Top 0.305: v36.2,1.91 v36.2,13.34 | v67.94,12.06 v67.94,59.69
  Bottom 0.305: IC8.25 69.85,13.34 68.58,12.06 v67.94,12.06 50.16,12.06 48.9,13.34 v36.2,13.34 IC4.25 | IC7.11 52.7,60.33 53.34,59.69 v67.94,59.69 | IC3.17 7.62,13.34 6.99,12.7 6.99,2.54 7.62,1.91 v36.2,1.91
A9  (via drill 0.7)
  Top 0.305: v33.02,6.99 v33.02,15.88 | v66.67,52.7 v66.67,14.61
  Bottom 0.305: IC8.24 69.85,15.88 68.58,14.61 v66.67,14.61 50.16,14.61 48.9,15.88 IC4.24 v33.02,15.88 | IC3.18 8.89,10.79 8.26,10.16 8.26,7.62 8.89,6.99 v33.02,6.99 | IC7.6 57.78,53.34 58.42,52.7 v66.67,52.7
A10  (via drill 0.7)
  Top 0.305: v37.47,9.53 v37.47,23.5 | v65.41,51.44 v65.41,22.23
  Bottom 0.305: IC8.21 69.85,23.5 68.58,22.23 v65.41,22.23 50.16,22.23 48.9,23.5 IC4.21 v37.47,23.5 | IC3.19 22.86,8.26 24.13,9.53 v37.47,9.53 | IC7.5 55.24,52.07 55.88,51.44 v65.41,51.44
A11  (via drill 0.7)
  Top 0.305: v38.73,3.17 v38.73,18.41 | v64.14,50.16 v64.14,17.14
  Bottom 0.305: IC8.23 69.85,18.41 68.58,17.14 v64.14,17.14 50.16,17.14 48.9,18.41 IC4.23 v38.73,18.41 | IC3.20 13.97,5.71 16.51,3.17 v38.73,3.17 | IC7.4 52.7,50.8 53.34,50.16 v64.14,50.16
A12  (via drill 0.7)
  Top 0.305: v61.59,48.9 v61.59,8.26
  Bottom 0.305: IC3.22 36.83,8.26 38.1,6.99 48.9,6.99 50.16,8.26 IC4.2 v61.59,8.26 67.31,8.26 68.58,6.99 77.47,6.99 78.74,8.26 IC8.2 | IC7.3 50.16,49.53 50.8,48.9 v61.59,48.9
A13  (via drill 0.7)
  Top 0.305: v60.33,47.62 v60.33,9.53
  Bottom 0.305: IC3.23 IC4.26 48.9,10.79 50.16,9.53 v60.33,9.53 69.22,9.53 70.48,10.79 IC8.26 | IC7.2 47.62,48.26 48.26,47.62 v60.33,47.62
A14  (via drill 0.7)
  Top 0.305: v31.75,13.34 v31.75,4.45 | v59.05,46.35 v59.05,5.71
  Bottom 0.305: IC8.1 78.74,5.71 77.47,4.45 68.58,4.45 67.31,5.71 v59.05,5.71 IC4.1 50.16,5.71 48.9,4.45 v31.75,4.45 | IC3.24 v31.75,13.34 | IC7.1 45.09,46.99 45.72,46.35 v59.05,46.35
A15  (via drill 0.7)
  Top 0.305: v23.5,15.88 23.5,44.45 24.13,45.09 36.83,45.09 37.47,45.72 v37.47,67.94
  Bottom 0.305: IC3.25 v23.5,15.88 | v37.47,67.94 49.53,67.94 50.16,68.58 IC1.3
CLK
  Bottom 0.305: QG1.8 15.88,62.23 16.51,61.59 16.51,46.99 17.14,46.35 IC3.37
D0  (via drill 0.7)
  Top 0.305: v28.57,36.2 v28.57,32.38 | v97.79,22.23 v97.79,31.11 v97.79,86.36
  Bottom 0.305: IC3.33 v28.57,36.2 | v28.57,32.38 48.9,32.38 50.16,31.11 IC4.11 68.58,31.11 69.85,32.38 77.47,32.38 78.74,31.11 IC8.11 v97.79,31.11 | v97.79,22.23 IC9.33 | v97.79,86.36 IC5.18
D1  (via drill 0.7)
  Top 0.305: v83.82,24.77 v83.82,33.66 v83.82,83.82
  Bottom 0.305: IC3.32 28.57,33.66 28.57,34.92 48.9,34.92 50.16,33.66 IC4.12 68.58,33.66 69.85,34.92 77.47,34.92 78.74,33.66 IC8.12 v83.82,33.66 | v83.82,24.77 IC9.32 | v83.82,83.82 IC5.19
D2  (via drill 0.7)
  Top 0.305: v29.84,31.11 v29.84,37.47 | v96.52,27.3 v96.52,36.2 v96.52,81.28
  Bottom 0.305: IC3.31 v29.84,31.11 | v29.84,37.47 48.9,37.47 50.16,36.2 IC4.13 68.58,36.2 69.85,37.47 77.47,37.47 78.74,36.2 IC8.13 v96.52,36.2 | v96.52,27.3 IC9.31 | IC5.20 v96.52,81.28
D3  (via drill 0.7)
  Top 0.305: v31.11,28.57 v31.11,38.73 | v88.9,29.84 v88.9,38.73 v88.9,78.74
  Bottom 0.305: IC3.30 v31.11,28.57 | v31.11,38.73 IC4.15 48.9,38.73 50.16,37.47 68.58,37.47 69.85,38.73 IC8.15 77.47,38.73 78.74,37.47 84.45,37.47 85.72,38.73 v88.9,38.73 | v88.9,29.84 IC9.30 | IC5.21 v88.9,78.74
D4  (via drill 0.7)
  Top 0.305: v32.38,26.04 v32.38,36.2 | v100.33,76.2 v100.33,32.38
  Bottom 0.305: IC3.29 v32.38,26.04 | v32.38,36.2 IC4.16 48.9,36.2 50.16,34.92 68.58,34.92 69.85,36.2 IC8.16 77.47,36.2 78.74,34.92 85.72,34.92 87,33.66 90.17,33.66 91.44,32.38 IC9.29 v100.33,32.38 | IC5.22 v100.33,76.2
D5  (via drill 0.7)
  Top 0.305: v33.66,23.5 v33.66,33.66 | v87.63,32.38 v87.63,34.92 v87.63,73.66
  Bottom 0.305: IC3.28 v33.66,23.5 | v33.66,33.66 IC4.17 48.9,33.66 50.16,32.38 68.58,32.38 69.85,33.66 IC8.17 77.47,33.66 78.74,32.38 v87.63,32.38 | IC9.28 v87.63,34.92 | IC5.23 v87.63,73.66
D6  (via drill 0.7)
  Top 0.305: v34.92,20.95 v34.92,31.11 | v86.36,29.84 v86.36,37.47 v86.36,71.12
  Bottom 0.305: IC3.27 v34.92,20.95 | v34.92,31.11 IC4.18 48.9,31.11 50.16,29.84 68.58,29.84 69.85,31.11 IC8.18 77.47,31.11 78.74,29.84 v86.36,29.84 | IC9.27 v86.36,37.47 | IC5.24 v86.36,71.12
D7  (via drill 0.7)
  Top 0.305: v36.2,18.41 v36.2,28.57 | v85.09,27.3 v85.09,40.01 v85.09,68.58
  Bottom 0.305: IC3.26 v36.2,18.41 | v36.2,28.57 IC4.19 48.9,28.57 50.16,27.3 68.58,27.3 69.85,28.57 IC8.19 77.47,28.57 78.74,27.3 v85.09,27.3 | IC9.26 v85.09,40.01 | IC5.25 v85.09,68.58
GND  (via drill 0.7)
  Top 0.305: v21.59,5.71 v21.59,10.16 | v63.5,72.39 v63.5,78.11
  Bottom 0.305: IC10.4 76.2,77.47 76.83,76.83 76.83,67.94 76.2,67.31 IC10.8 | IC3.21 v21.59,5.71
  pour Bottom (isolate 0.305): 0,0 0,100 160,100 160,0
LCD_D4  (via drill 0.7)
  Top 0.305: v116.2,23.5 v116.2,6.99
  Bottom 0.305: JP2.4 120.02,23.5 v116.2,23.5 | v116.2,6.99 IC9.2
LCD_D5  (via drill 0.7)
  Top 0.305: v114.94,24.77 v114.94,9.53
  Bottom 0.305: JP2.3 v114.94,24.77 | v114.94,9.53 IC9.3
LCD_D6  (via drill 0.7)
  Top 0.305: v113.67,26.04 v113.67,12.06
  Bottom 0.305: JP2.2 120.02,26.04 v113.67,26.04 | v113.67,12.06 IC9.4
LCD_D7  (via drill 0.7)
  Top 0.305: v112.39,27.3 v112.39,14.61
  Bottom 0.305: JP2.1 v112.39,27.3 | v112.39,14.61 IC9.5
LCD_E1
  Bottom 0.305: IC9.7 115.57,19.68 116.2,19.05 116.2,17.78 116.84,17.14 JP2.9
LCD_E2
  Bottom 0.305: JP2.15 116.84,9.53 115.57,8.26 107.31,8.26 106.68,8.89 106.68,21.59 107.31,22.23 IC9.8
LCD_RS
  Bottom 0.305: IC9.6 114.3,17.14 114.94,16.51 114.94,15.24 115.57,14.61 JP2.11
N$1
  Bottom 0.305: IC5.7 115.44,76.2 Q1.2 116.84,77.34 C7.2
N$2
  Bottom 0.305: IC5.6 111.76,73.66 114.3,71.12 115.44,71.12 Q1.1
N$3
  Bottom 0.305: IC3.2 R4.1
N$4
  Bottom 0.305: 29.84,71.12 IC2.7 IC2.6 | 29.84,71.12 30.48,71.12 C4.+ | R2.1 29.84,71.12
N$5  (via drill 0.7)
  Top 0.305: v40.01,72.39 34.92,72.39 32.38,69.85 22.23,69.85 v20.95,68.58
  Bottom 0.305: IC1.1 v40.01,72.39 | v20.95,68.58 IC2.3
N$6
  Bottom 0.305: RESET.2 29.21,89.54 29.21,88.9 26.67,86.36 R1.1 26.67,81.28 23.5,78.11 C3.2 23.5,76.2 20.95,73.66 20.95,71.75 20.32,71.12 IC2.2
N$7
  Bottom 0.305: IC6.3 50.16,85.09 50.8,84.45 52.07,84.45 52.7,83.82 IC1.11
N$8
  Bottom 0.305: IC5.10 112.39,83.82 113.03,84.45 113.03,90.81 113.67,91.44 JP1.2
N$9
  Bottom 0.305: R10.2 87.63,15.24 88.27,15.88 104.78,15.88 105.41,16.51 105.41,24.13 106.05,24.77 IC9.9
N$10
  Bottom 0.305: IC3.6 R6.1
N$11
  Bottom 0.305: R7.1 IC3.38
N$12
  Bottom 0.305: IC5.12 111.12,88.9 111.76,89.53 111.76,93.34 112.39,93.98 JP1.3
N$13
  Bottom 0.305: IC6.4 52.7,85.72 53.34,85.09 54.61,85.09 55.24,84.45 IC1.10
N$14
  Bottom 0.305: R8.2 118.75,30.48 119.38,29.84 122.56,29.84 123.19,29.21 123.19,15.24 122.56,14.61 JP2.12
N$15
  Bottom 0.305: R9.2 117.47,5.71 JP2.17
N$16
  Bottom 0.305: LED1.A R10.1
PHI2  (via drill 0.7)
  Top 0.305: v91.44,42.55 v91.44,45.09 v91.44,63.5
  Bottom 0.305: IC6.5 55.24,89.53 54.61,90.17 44.45,90.17 35.56,81.28 35.56,51.44 | 35.56,51.44 35.56,45.72 36.2,45.09 v91.44,45.09 | IC3.39 35.56,51.44 | v91.44,63.5 IC5.27 | IC9.25 v91.44,42.55
R!W  (via drill 0.7)
  Top 0.305: v69.22,8.26 v69.22,41.27 v69.22,60.96
  Bottom 0.305: IC3.34 27.3,38.73 28.57,40.01 57.15,40.01 58.42,41.27 v69.22,41.27 | v69.22,8.26 IC8.27 | v69.22,60.96 90.81,60.96 IC5.28 95.89,60.96 96.52,60.33 96.52,50.8 95.89,50.16 IC9.22
VCC  (via drill 0.7)
  Top 0.305: v44.45,8.26 v44.45,5.71 v44.45,2.54 | v17.14,5.71 v17.14,36.2 | v42.55,64.77 v42.55,80.01 v42.55,94.61 | v70.48,5.71 v70.48,2.54 | v106.68,63.5 v106.68,97.79
  Bottom 0.305: J1.2 7.26,91.72 8.26,92.71 11.89,92.71 | 11.89,92.71 J1.3 | J1.2 7.26,78.46 8.26,77.47 QG1.14 12.06,66.67 12.7,66.04 IC2.4 18.41,63.5 | R1.2 26.04,76.83 IC2.8 23.5,73.66 22.86,73.03 22.86,63.5 | 18.41,63.5 18.41,62.23 | 18.41,62.23 18.41,59.05 19.05,58.42 R3.2 | C2.2 18.41,62.23 | J1.2 3.17,89.53 2.54,88.9 2.54,53.98 R4.2 R5.2 R6.2 2.54,36.83 3.17,36.2 C5.2 IC3.8 v17.14,36.2 | R7.2 R2.2 22.86,63.5 | v17.14,5.71 18.41,4.45 27.94,4.45 29.21,5.71 IC4.28 v44.45,5.71 48.9,5.71 50.16,6.99 67.31,6.99 68.58,5.71 v70.48,5.71 IC8.28 | IC4.27 v44.45,8.26 | IC7.14 v42.55,64.77 41.91,64.77 41.27,64.14 C11.2 | C1.2 41.27,79.38 41.91,80.01 v42.55,80.01 IC1.14 | 11.89,92.71 11.89,93.17 13.34,94.61 41.27,94.61 | 41.27,94.61 v42.55,94.61 42.55,95.25 | C10.2 41.27,94.61 | v70.48,2.54 C9.2 | C6.2 v44.45,2.54 | 22.86,63.5 18.41,63.5 | IC10.16 81.28,87 | 81.28,87 81.28,88.9 | 81.28,88.9 81.28,97.79 | C12.2 81.28,88.9 | IC5.2 v106.68,63.5 106.68,52.7 | 123.83,12.06 123.83,33.66 123.19,34.29 R8.1 121.28,97.16 120.65,97.79 v106.68,97.79 90.17,97.79 | 123.83,12.06 123.83,4.45 R9.1 | JP2.14 123.83,12.06 | IC10.6 75.56,72.39 76.2,73.03 76.2,75.56 75.56,76.2 72.39,76.2 71.75,76.83 71.75,86.36 72.39,87 81.28,87 | 81.28,97.79 43.18,97.79 42.55,97.16 42.55,95.25 | IC9.24 104.78,45.09 105.41,45.72 105.41,52.07 106.05,52.7 106.68,52.7 | 106.68,52.7 IC9.20 C13.2 | IC6.14 42.55,95.25 | IC5.15 C8.2 90.17,97.79 | 81.28,97.79 90.17,97.79